# EAGLE design light (EAGLE 7.3.0)
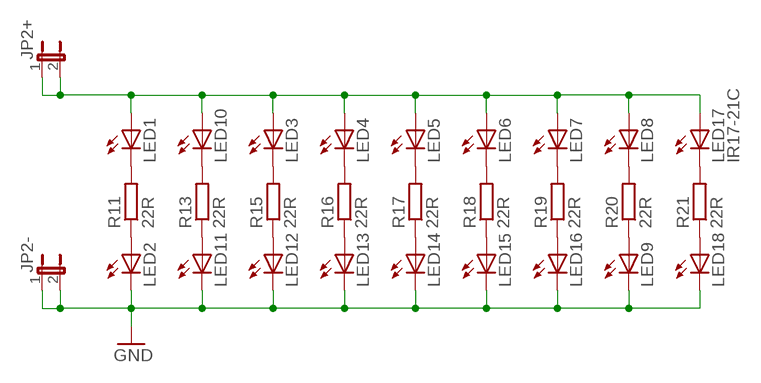
[diagram p0: schematic, sheet 1]

## Parts
JP2+  JP1E  [JP1]
JP2-  JP1E  [JP1]
LED1  LEDCHIPLED_0805  [CHIPLED_0805]
LED2  LEDCHIPLED_0805  [CHIPLED_0805]
LED3  LEDCHIPLED_0805  [CHIPLED_0805]
LED4  LEDCHIPLED_0805  [CHIPLED_0805]
LED5  LEDCHIPLED_0805  [CHIPLED_0805]
LED6  LEDCHIPLED_0805  [CHIPLED_0805]
LED7  LEDCHIPLED_0805  [CHIPLED_0805]
LED8  LEDCHIPLED_0805  [CHIPLED_0805]
LED9  LEDCHIPLED_0805  [CHIPLED_0805]
LED10  LEDCHIPLED_0805  [CHIPLED_0805]
LED11  LEDCHIPLED_0805  [CHIPLED_0805]
LED12  LEDCHIPLED_0805  [CHIPLED_0805]
LED13  LEDCHIPLED_0805  [CHIPLED_0805]
LED14  LEDCHIPLED_0805  [CHIPLED_0805]
LED15  LEDCHIPLED_0805  [CHIPLED_0805]
LED16  LEDCHIPLED_0805  [CHIPLED_0805]
LED17  IR17-21C  LEDCHIPLED_0805  [CHIPLED_0805]
LED18  LEDCHIPLED_0805  [CHIPLED_0805]
R11  22R  R-EU_M0805  [M0805]
R13  22R  R-EU_M0805  [M0805]
R15  22R  R-EU_M0805  [M0805]
R16  22R  R-EU_M0805  [M0805]
R17  22R  R-EU_M0805  [M0805]
R18  22R  R-EU_M0805  [M0805]
R19  22R  R-EU_M0805  [M0805]
R20  22R  R-EU_M0805  [M0805]
R21  22R  R-EU_M0805  [M0805]

## Nets
+3V3: JP2+.1 JP2+.2 LED1.A LED3.A LED4.A LED5.A LED6.A LED7.A LED8.A LED10.A LED17.A
GND: JP2-.1 JP2-.2 LED2.C LED9.C LED11.C LED12.C LED13.C LED14.C LED15.C LED16.C LED18.C
N$2: LED2.A R11.1
N$13: LED1.C R11.2
N$14: LED10.C R13.2
N$15: LED11.A R13.1
N$16: LED3.C R15.2
N$17: LED4.C R16.2
N$18: LED5.C R17.2
N$19: LED6.C R18.2
N$20: LED7.C R19.2
N$21: LED8.C R20.2
N$22: LED9.A R20.1
N$23: LED12.A R15.1
N$24: LED13.A R16.1
N$27: LED14.A R17.1
N$28: LED15.A R18.1
N$29: LED16.A R19.1
N$30: LED18.A R21.1
N$31: LED17.C R21.2

## Library data of the parts
JP2+ JP2- = jumper:JP1E: JUMPER
LED1-LED18 = led:LED: LED OSRAM: - CHIPLED LG R971, LG N971, LY N971, LG Q971, LY Q971, LO R971, LY R971 LH N974, LH R974 LS Q976, LO Q976, LY Q976 LO Q996 - Hyper CHIPLED LW Q18S LB Q993, LB Q99A, LB R99A - SideLED LS A670, LO A670, LY A670, LG A670, LP A670 LB A673, LV A673, LT A673, LW A673 LH A674 LY A675 LS A676, LA A676, LO A676, LY A676, LW A676 LS A679, LY A679, LG A679 - Hyper Micro SIDELED® LS Y876, LA Y876, LO Y876, LY Y876 LT Y87S - SmartLED LW L88C, LW L88S LB L89C, LB L89S, LG L890 LS L89K, LO L89K, LY L89K LS L896, LA L896, LO L896, LY L896 - TOPLED LS T670, LO T670, LY T670, LG T670, LP T670 LSG T670, LSP T670, LSY T670, LOP T670, LYG T670 LG T671, LOG T671, LSG T671 LB T673, LV T673, LT T673, LW T673 LH T674 LS T676, LA T676, LO T676, LY T676, LB T676, LH T676, LSB T676, LW T676 LB T67C, LV T67C, LT T67C, LS T67K, LO T67K, LY T67K, LW E67C LS E67B, LA E67B, LO E67B, LY E67B, LB E67C, LV E67C, LT E67C LW T67C LS T679, LY T679, LG T679 LS T770, LO T770, LY T770, LG T770, LP T770 LB T773, LV T773, LT T773, LW T773 LH T774 LS E675, LA E675, LY E675, LS T675 LS T776, LA T776, LO T776, LY T776, LB T776 LHGB T686 LT T68C, LB T68C - Hyper Mini TOPLED® LB M676 - Mini TOPLED Santana® LG M470 LS M47K, LO M47K, LY M47K Source: http://www.osram.convergy.de LUXEON: - LUMILED® LXK2-PW12-R00, LXK2-PW12-S00, LXK2-PW14-U00, LXK2-PW14-V00 LXK2-PM12-R00, LXK2-PM12-S00, LXK2-PM14-U00 LXK2-PE12-Q00, LXK2-PE12-R00, LXK2-PE12-S00, LXK2-PE14-T00, LXK2-PE14-U00 LXK2-PB12-K00, LXK2-PB12-L00, LXK2-PB12-M00, LXK2-PB14-N00, LXK2-PB14-P00, LXK2-PB14-Q00 LXK2-PR12-L00, LXK2-PR12-M00, LXK2-PR14-Q00, LXK2-PR14-R00 LXK2-PD12-Q00, LXK2-PD12-R00, LXK2-PD12-S00 LXK2-PH12-R00, LXK2-PH12-S00 LXK2-PL12-P00, LXK2-PL12-Q00, LXK2-PL12-R00 Source: www.luxeon.com KINGBRIGHT: KA-3528ASYC Source: www.kingbright.com
R11 R13 R15-R21 = rcl:R-EU_: RESISTOR, European symbol

## Board
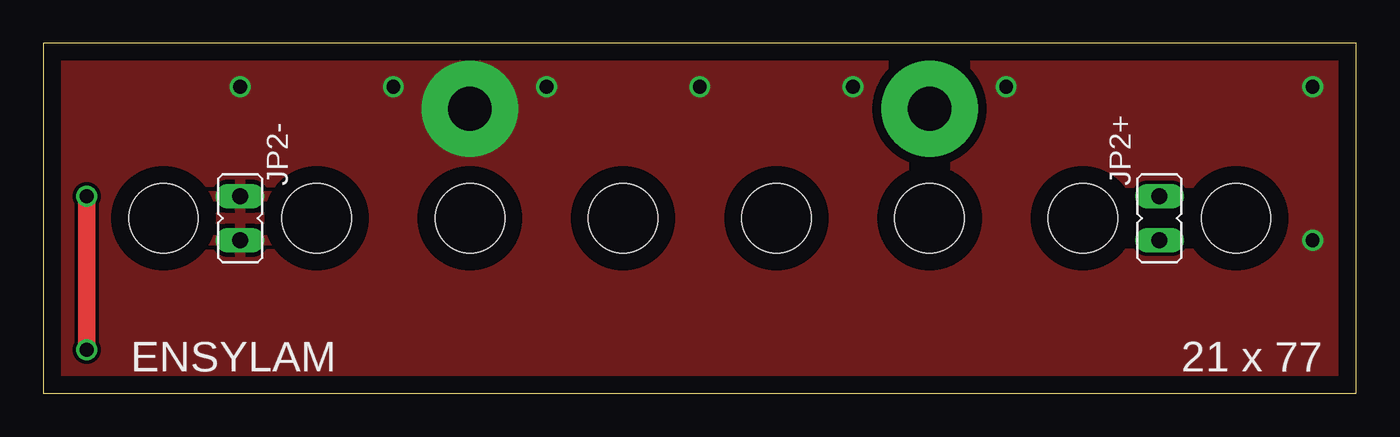
[diagram p1: board, top side]
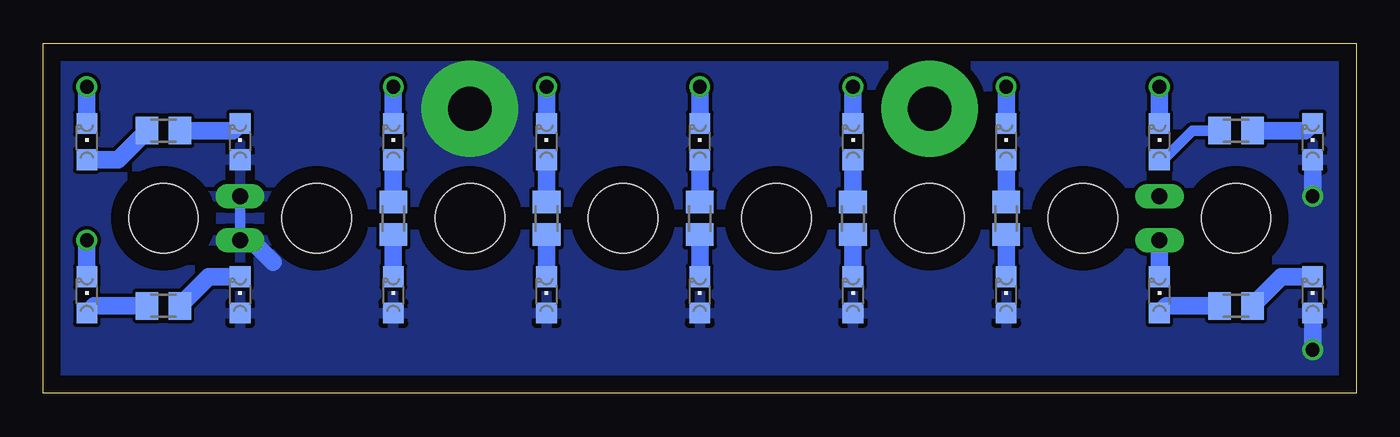
[diagram p2: board, bottom side, seen from below]

Size 76.2 x 20.32 mm. Coordinates in mm from the lower left corner, seen from the top.
Outline: 0,0 76.2,0 76.2,20.32 0,20.32 0,0
Copper layers (1*16): Top 0.035mm / dielectric 1.5mm / Bottom 0.035mm
Design rules "default": minimum track width 10mil, minimum drill 24mil, track to track 8mil, track to pad 8mil, pad to pad 8mil, via to via 8mil, smd to smd 8mil, copper to edge 40mil, drill to drill 8mil, minimum pad ring 10mil, minimum via ring 8mil, stop-mask expansion 4mil, vias tented up to drill 0mil, thermal gap 10mil
Holes 4.01 mm at 6.99,10.16 15.88,10.16 24.77,10.16 33.66,10.16 42.55,10.16 51.44,10.16 60.33,10.16 69.22,10.16
tRestrict: area 48.6,13.7 to 54.2,19.3
bRestrict: area 22,13.7 to 27.6,19.3

### Footprints (pad centres in the part's own frame; a part is rotated, then mirrored left to right if it is on the bottom)
JP1 = drill 0.914 long: 1 0,-1.27; 2 0,1.27
CHIPLED_0805 = smd 1.2 x 1.2: A 0,-1.05; C 0,1.05
M0805 = smd 1.3 x 1.6: 1 -0.95,0; 2 0.95,0

### Placement (x,y rotation side)
JP2+  64.77,10.16 180 top
JP2-  11.43,10.16 0 top
LED1  2.54,5.71 0 bottom
LED2  11.43,5.71 0 bottom
LED3  20.32,5.71 0 bottom
LED4  29.21,5.71 0 bottom
LED5  38.1,5.71 0 bottom
LED6  46.99,5.71 0 bottom
LED7  55.88,5.71 0 bottom
LED8  64.77,5.71 0 bottom
LED9  73.66,5.71 0 bottom
LED10  2.54,14.61 0 bottom
LED11  11.43,14.61 0 bottom
LED12  20.32,14.61 0 bottom
LED13  29.21,14.61 0 bottom
LED14  38.1,14.61 0 bottom
LED15  46.99,14.61 0 bottom
LED16  55.88,14.61 0 bottom
LED17  64.77,14.61 0 bottom
LED18  73.66,14.61 0 bottom
R11  6.99,5.08 0 bottom
R13  6.99,15.24 0 bottom
R15  20.32,10.16 270 bottom
R16  29.21,10.16 270 bottom
R17  38.1,10.16 270 bottom
R18  46.99,10.16 270 bottom
R19  55.88,10.16 270 bottom
R20  69.22,5.08 0 bottom
R21  69.22,15.24 0 bottom

### Tracks (layer width: path | path; a pad name or v marks a point on that pad's centre or on a via)
+3V3  (via drill 0.8, 2.54 pad 5.59)
  Top 1.016: v2.54,11.43 v2.54,2.54
  Bottom 0.61: JP2+.1 JP2+.2
  Bottom 1.016: JP2+.2 64.14,8.89 62.87,7.62 | LED10.A v2.54,11.43 | v2.54,2.54 LED1.A
  other vias: 51.44,16.51
  pour Bottom: 76.2,19.68 0,19.68 0,0 76.2,0
GND  (via drill 0.8, 2.54 pad 5.59)
  Bottom 1.016: LED9.C v73.66,8.89 | LED18.C v73.66,17.78 | LED11.C v11.43,17.78 | LED12.C v20.32,17.78 | LED13.C v29.21,17.78 | LED14.C v38.1,17.78 | LED15.C v46.99,17.78 | LED16.C v55.88,17.78 | LED2.C JP2-.1
  other vias: 24.77,16.51
  pour Top: 76.2,19.68 0,19.68 0,0 76.2,0
N$2
  Bottom 1.016: R11.1 11.02,5.08 LED2.A
N$13
  Bottom 1.016: LED1.C 4.35,6.76 R11.2
N$14
  Bottom 1.016: R13.2 2.96,15.24 LED10.C
N$15
  Bottom 0.61: LED11.A 11.21,13.55 9.53,15.24 R13.1
N$16
  Bottom 1.016: LED3.C R15.2
N$17
  Bottom 1.016: LED4.C R16.2
N$18
  Bottom 1.016: LED5.C R17.2
N$19
  Bottom 1.016: LED6.C R18.2
N$20
  Bottom 1.016: LED7.C R19.2
N$21
  Bottom 1.016: LED8.C 66.58,6.76 R20.2
N$22
  Bottom 1.016: R20.1 73.25,5.08 LED9.A
N$23
  Bottom 1.016: R15.1 LED12.A
N$24
  Bottom 1.016: R16.1 LED13.A
N$27
  Bottom 1.016: R17.1 LED14.A
N$28
  Bottom 1.016: R18.1 LED15.A
N$29
  Bottom 1.016: R19.1 LED16.A
N$30
  Bottom 1.016: LED18.A 71.85,13.55 R21.1
N$31
  Bottom 1.016: R21.2 65.19,15.24 LED17.C

### Text on the board
tPlace: ENSYLAM | 21 x 77